# Altium schematic sheet ESC.SchDoc
size A2
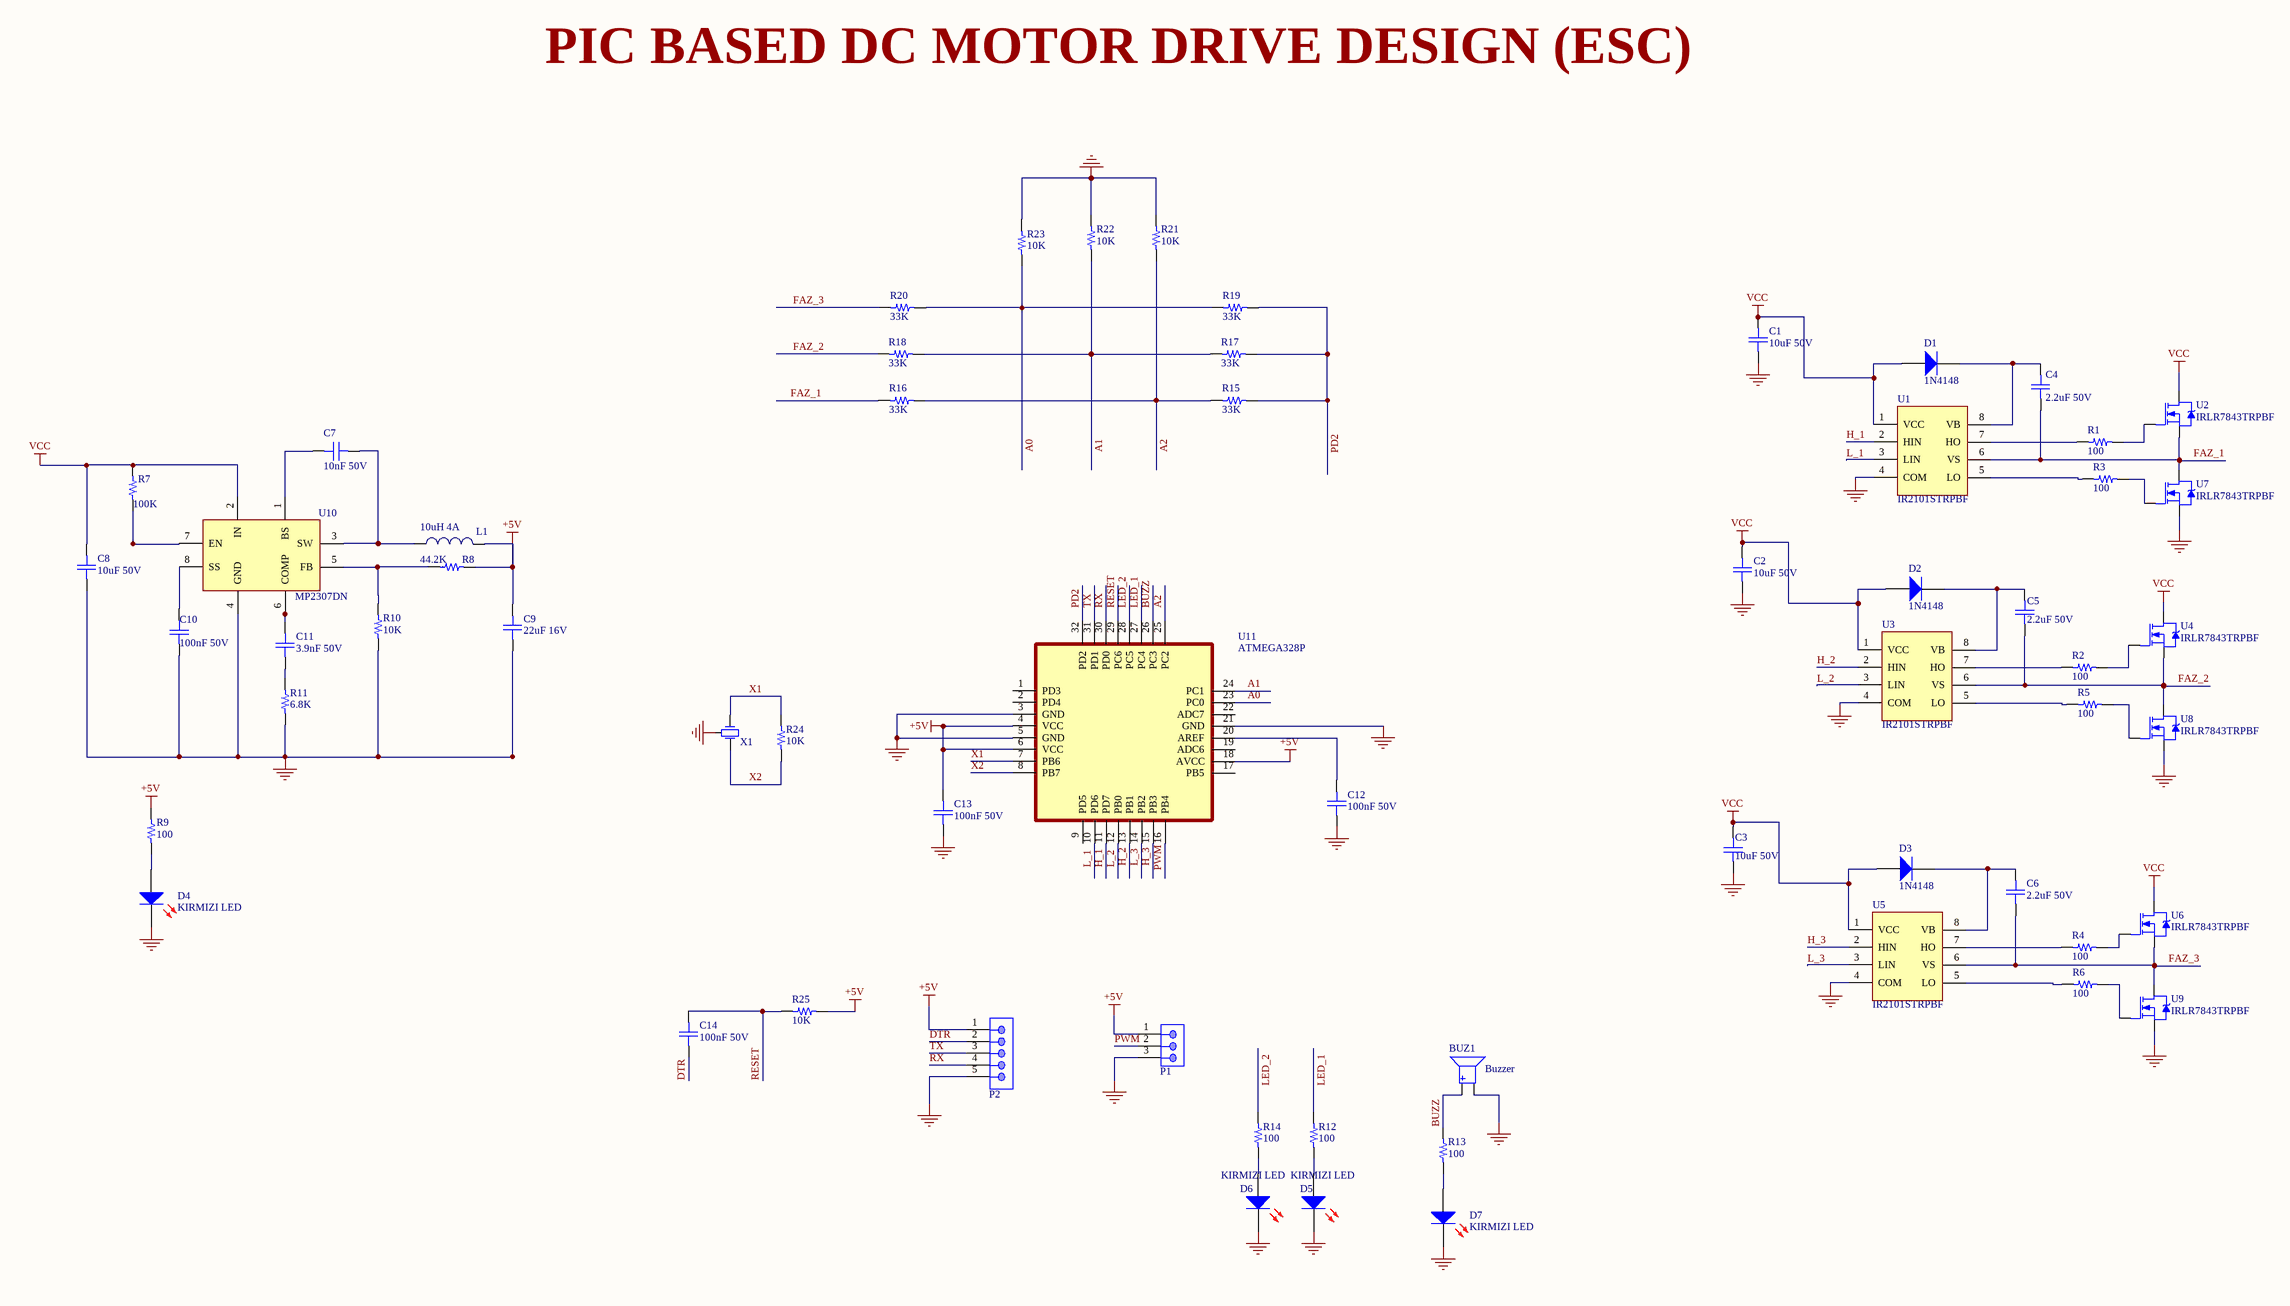
[diagram p0: ESC.SchDoc]

## Parts
BUZ1  Deger: Buzzer  [BUZ: CMT-7525]  (hidden comment: BUZZER MAGN 3.6V 7.5X7.5MM SMD)
C1  Deger: 10uF 50V  [CAP 1206/3216]  (hidden comment: CAP CER 10UF 50V X5R 1206)
C2  Deger: 10uF 50V  [CAP 1206/3216]  (hidden comment: CAP CER 10UF 50V X5R 1206)
C3  Deger: 10uF 50V  [CAP 1206/3216]  (hidden comment: CAP CER 10UF 50V X5R 1206)
C4  Deger: 2.2uF 50V  [CAP 1206/3216]  (hidden comment: CAP CER 2.2UF 50V X5R 1206)
C5  Deger: 2.2uF 50V  [CAP 1206/3216]  (hidden comment: CAP CER 2.2UF 50V X5R 1206)
C6  Deger: 2.2uF 50V  [CAP 1206/3216]  (hidden comment: CAP CER 2.2UF 50V X5R 1206)
C7  Deger: 10nF 50V  [CAP 0805/2012]  (hidden comment: CAP CER 10000PF 50V X7R 0805)
C8  Deger: 10uF 50V  [CAP 1206/3216]  (hidden comment: CAP CER 10UF 50V X5R 1206)
C9  Deger: 22uF 16V  [CAP 1206/3216]  (hidden comment: CAP CERAMIC 22UF 16V X7S 20% PAD)
C10  Deger: 100nF 50V  [CAP 0805/2012]  (hidden comment: CAP CER 0.1UF 50V X7R 0805)
C11  Deger: 3.9nF 50V  [CAP 0805/2012]  (hidden comment: CAP CER 3900PF 50V X7R 0805)
C12  Deger: 100nF 50V  [CAP 0805/2012]  (hidden comment: CAP CER 0.1UF 50V X7R 0805)
C13  Deger: 100nF 50V  [CAP 0805/2012]  (hidden comment: CAP CER 0.1UF 50V X7R 0805)
C14  Deger: 100nF 50V  [CAP 0805/2012]  (hidden comment: CAP CER 0.1UF 50V X7R 0805)
D1  1N4148 Diyot  [SOD-123]  (value not drawn)
D2  1N4148 Diyot  [SOD-123]  (value not drawn)
D3  1N4148 Diyot  [SOD-123]  (value not drawn)
D4  Deger: KIRMIZI LED  [SMD: LED 0805/2012 RED]  (hidden comment: Red 645nm LED Indication - Discrete 1.8V 0805)
D5  Deger: KIRMIZI LED  [SMD: LED 0805/2012 RED]  (hidden comment: Red 645nm LED Indication - Discrete 1.8V 0805)
D6  Deger: KIRMIZI LED  [SMD: LED 0805/2012 RED]  (hidden comment: Red 645nm LED Indication - Discrete 1.8V 0805)
D7  Deger: KIRMIZI LED  [SMD: LED 0805/2012 RED]  (hidden comment: Red 645nm LED Indication - Discrete 1.8V 0805)
L1  FIXED IND 10UH 4A 68 MOHM SMD  [ASPI-0630LR-100M-T15]  (value not drawn)
P1  WR-PHD 2.54 mm Angled Socket Header  [PWM_CONN]  (value not drawn)
P2  WR-PHD 2.54 mm Angled Socket Header  [TTL_CONN_5]  (value not drawn)
R1  100  [RES_0805]
R2  100  [RES_0805]
R3  100  [RES_0805]
R4  100  [RES_0805]
R5  100  [RES_0805]
R6  100  [RES_0805]
R7  100K  [RES_0805]
R8  44.2K  [RES_0805]
R9  100  [RES_0805]
R10  10K  [RES_0805]
R11  6.8K  [RES_0805]
R12  100  [RES_0805]
R13  100  [RES_0805]
R14  100  [RES_0805]
R15  33K  [RES_0805]
R16  33K  [RES_0805]
R17  33K  [RES_0805]
R18  33K  [RES_0805]
R19  33K  [RES_0805]
R20  33K  [RES_0805]
R21  10K  [RES_0805]
R22  10K  [RES_0805]
R23  10K  [RES_0805]
R24  10K  [RES_0805]
R25  10K  [RES_0805]
U1  Deger: IR2101STRPBF  [SOIC8]  (hidden comment: IC GATE DRVR HALF-BRIDGE 8SOIC)
U2  Deger: IRLR7843TRPBF  [DPAK]  (hidden comment: MOSFET N-CH 30V 161A DPAK)
U3  Deger: IR2101STRPBF  [SOIC8]  (hidden comment: IC GATE DRVR HALF-BRIDGE 8SOIC)
U4  Deger: IRLR7843TRPBF  [DPAK]  (hidden comment: MOSFET N-CH 30V 161A DPAK)
U5  Deger: IR2101STRPBF  [SOIC8]  (hidden comment: IC GATE DRVR HALF-BRIDGE 8SOIC)
U6  Deger: IRLR7843TRPBF  [DPAK]  (hidden comment: MOSFET N-CH 30V 161A DPAK)
U7  Deger: IRLR7843TRPBF  [DPAK]  (hidden comment: MOSFET N-CH 30V 161A DPAK)
U8  Deger: IRLR7843TRPBF  [DPAK]  (hidden comment: MOSFET N-CH 30V 161A DPAK)
U9  Deger: IRLR7843TRPBF  [DPAK]  (hidden comment: MOSFET N-CH 30V 161A DPAK)
U10  IC REG BUCK ADJUSTABLE 3A 8SOIC  [SOIC8_PAD]  (value not drawn)
U11  IC MCU 8BIT 32KB FLASH 32TQFP  [TQFP32]  (value not drawn)
X1  CERAMIC RES 16.0000MHZ 15PF SMD  [CRYSTAL_16MHZ(CTSE16)]  (value not drawn)

## Nets
+5V: C9.2 C13.2 L1.2 P1.1 P2.1 R8.2 R9.2 R25.2 U11.4(VCC) U11.6(VCC) U11.18(AVCC)
GND: BUZ1.2(Negative) C1.1 C2.1 C3.1 C8.1 C9.1 C10.1 C12.1 C13.1 D4.2(K) D5.2(K) D6.2(K) D7.2(K) P1.3 P2.5 R10.1 R11.1 R21.1 R22.1 R23.1 U1.4(COM) U3.4(COM) U5.4(COM) U7.3(S) U8.3(S) U9.3(S) U10.4(GND) U11.3(GND) U11.5(GND) U11.21(GND) X1.2(GND)
VCC: C1.2 C2.2 C3.2 C8.2 D1.1(A) D2.1(A) D3.1(A) R7.2 U1.1(VCC) U2.4(D) U3.1(VCC) U4.4(D) U5.1(VCC) U6.4(D) U10.2(IN)
A0: R19.2 R20.1 R23.2 U11.23(PC0)
A1: R17.2 R18.1 R22.2 U11.24(PC1)
A2: R15.2 R16.1 R21.2 U11.25(PC2)
BUZZ: BUZ1.1(Positive) R13.2 U11.26(PC3)
DTR: C14.1 P2.2
FAZ_1: C4.1 R16.2 U1.6(VS) U2.3(S) U7.4(D)
FAZ_2: C5.1 R18.2 U3.6(VS) U4.3(S) U8.4(D)
FAZ_3: C6.1 R20.2 U5.6(VS) U6.3(S) U9.4(D)
H_1: U1.2(HIN) U11.11(PD7)
H_2: U3.2(HIN) U11.13(PB1)
H_3: U5.2(HIN) U11.15(PB3)
L_1: U1.3(LIN) U11.10(PD6)
L_2: U3.3(LIN) U11.12(PB0)
L_3: U5.3(LIN) U11.14(PB2)
LED_1: R12.2 U11.27(PC4)
LED_2: R14.2 U11.28(PC5)
PD2: R15.1 R17.1 R19.1 U11.32(PD2)
PWM: P1.2 U11.16(PB4)
RESET: C14.2 R25.1 U11.29(PC6)
RX: P2.4 U11.30(PD0)
TX: P2.3 U11.31(PD1)
X1: R24.1 U11.7(PB6) X1.1(OSC1)
X2: R24.2 U11.8(PB7) X1.3(OSC2)
NetC4_2: C4.2 D1.2(K) U1.8(VB)
NetC5_2: C5.2 D2.2(K) U3.8(VB)
NetC6_2: C6.2 D3.2(K) U5.8(VB)
NetC7_1: C7.1 U10.1(BS)
NetC7_2: C7.2 L1.1 U10.3(SW)
NetC10_2: C10.2 U10.8(SS)
NetC11_1: C11.1 R11.2
NetC11_2: C11.2 U10.6(COMP)
NetC12_2: C12.2 U11.20(AREF)
NetD4_1: D4.1(A) R9.1
NetD5_1: D5.1(A) R12.1
NetD6_1: D6.1(A) R14.1
NetD7_1: D7.1(A) R13.1
NetR1_1: R1.1 U1.7(HO)
NetR1_2: R1.2 U2.1(G)
NetR2_1: R2.1 U3.7(HO)
NetR2_2: R2.2 U4.1(G)
NetR3_1: R3.1 U1.5(LO)
NetR3_2: R3.2 U7.1(G)
NetR4_1: R4.1 U5.7(HO)
NetR4_2: R4.2 U6.1(G)
NetR5_1: R5.1 U3.5(LO)
NetR5_2: R5.2 U8.1(G)
NetR6_1: R6.1 U5.5(LO)
NetR6_2: R6.2 U9.1(G)
NetR7_1: R7.1 U10.7(EN)
NetR8_1: R8.1 R10.2 U10.5(FB)

Not connected (* = marked no-connect by the designer): U11 1(PD3) 2(PD4) 9(PD5) 17(PB5) 19(ADC6) 22(ADC7)

## Notes on the sheet
- PIC BASED DC MOTOR DRIVE DESIGN (ESC)

## Library data of the parts
BUZ1 = Buzzer(CMT-7525-80-SMT-TR): Buzzers Transducer, Externally Driven Magnetic 3.6V 100mA 2.73kHz 80dB @ 3.6V, 10cm Surface Mount Solder Pads; Kılıf: Nonstandard; -Sicaklik: -40; +Sicaklik: +85; Cins: Buzzer; Uretici Kodu: CMT-7525-80-SMT-TR; MSL: 1 (Unlimited); Lehim Yöntemi: SMD
C1-C3 C8 = 10uF 50V 1206: 10µF ±10% 50V Ceramic Capacitor X5R 1206 (3216 Metric); Cins: Kondansator; Uretici Kodu: CL31A106KBHNNNE; Kılıf: 1206; -Sicaklik: -55; +Sicaklik: +125; Lehim Yöntemi: SMD; MSL: 1 (Unlimited)
C4-C6 = 2.2uF 50V 1206: 2.2µF ±10% 50V Ceramic Capacitor X5R 1206 (3216 Metric); Cins: Kondansator; Uretici Kodu: CL31A225KBHNNNE; Kılıf: 1206; -Sicaklik: -55; +Sicaklik: +85; Lehim Yöntemi: SMD; MSL: 1 (Unlimited)
C7 = 10nF 50V 0805: 10000pF ±10% 50V Ceramic Capacitor X7R 0805 (2012 Metric); Cins: Kondansator; Uretici Kodu: CL21B103KBANNNC; Kılıf: 0805; -Sicaklik: -55; +Sicaklik: +125; Lehim Yöntemi: SMD; MSL: 1 (Unlimited)
C9 = 22uF 16V 1206: 22µF ±20% 16V Ceramic Capacitor X7S 1206 (3216 Metric); Cins: Kondansator; Uretici Kodu: GRM31CC71C226ME11L; Kılıf: 1206; -Sicaklik: -55; +Sicaklik: +125; Lehim Yöntemi: SMD; MSL: 1 (Unlimited)
C10 C12-C14 = 100nF 50V 0805: 0.1µF ±10% 50V Ceramic Capacitor X7R 0805 (2012 Metric); Kılıf: 0805; Cins: Kondansator; Uretici Kodu: CL21B104KBCNNNC; -Sicaklik: -55; +Sicaklik: +125; Lehim Yöntemi: SMD; MSL: 1 (Unlimited)
C11 = 3.9nF 50V 0805: 3900pF ±10% 50V Ceramic Capacitor X7R 0805 (2012 Metric); Cins: Kondansator; Uretici Kodu: CL21B392KBANNNC; Kılıf: 0805; -Sicaklik: -55; +Sicaklik: +125; Lehim Yöntemi: SMD; MSL: 1 (Unlimited)
D1-D3 = 1N4148: DIODE GEN PURP 100V 150MA SOD123; Uretici Kodu: 1N4148W-TP; -Sicaklik: -65; +Sicaklik: +150; Lehim Yöntemi: SMD; Cins: Diyot; Kılıf: SOD123; MSL: 1 (Unlimited); Deger: 1N4148
D4-D7 = LED_Kırmızı: LED RED DIFFUSED 0805 SMD; Uretici Kodu: LH R974-LP-1; Kılıf: 0805; -Sicaklik: -40; +Sicaklik: +125; Cins: LED; Lehim Yöntemi: SMD; MSL: 1 (Unlimited)
L1 = 10uH 4A: 10µH Shielded Molded Inductor 4A 68mOhm Max Nonstandard; Cins: Bobin; -Sicaklik: -55; +Sicaklik: +125; Uretici Kodu: ASPI-0630LR-100M-T15; Kılıf: Nonstandard; Lehim Yöntemi: SMD; MSL: 1 (Unlimited); Deger: 10uH 4A
P1 = HDR(1X3): Cins: Konnektor; Uretici Kodu: 613003143121; Kılıf: 3POS 2.54MM; -Sicaklik: -40; +Sicaklik: +105; Lehim Yöntemi: MANUEL; MSL: 1 (Unlimited)
P2 = HDR(1X5): Cins: Konnektor; Uretici Kodu: 613005143121; Kılıf: 5POS 2.54MM; -Sicaklik: -40; +Sicaklik: +105; Lehim Yöntemi: MANUEL; MSL: 1 (Unlimited)
R1-R6 R9 R12-R14 = 100R 0805: 100 Ohms ±1% 0.125W, 1/8W Chip Resistor 0805 (2012 Metric) Moisture Resistant Thick Film; Cins: Direnc; Uretici Kodu: RC0805FR-07100RL; Kılıf: 0805; -Sicaklik: -55; +Sicaklik: +155; Lehim Yöntemi: SMD; Deger: 100R; MSL: 1 (Unlimited)
R7 = 100K 0805: 100 kOhms ±1% 0.125W, 1/8W Chip Resistor 0805 (2012 Metric) Moisture Resistant Thick Film; Cins: Direnc; Uretici Kodu: RC0805FR-07100KL; Kılıf: 0805; -Sicaklik: -55; +Sicaklik: +155; Lehim Yöntemi: SMD; MSL: 1 (Unlimited); Deger: 100K
R8 = 44.2K 0805: 44.2 kOhms ±1% 0.125W, 1/8W Chip Resistor 0805 (2012 Metric) Moisture Resistant Thick Film; Cins: Direnc; Uretici Kodu: RC0805FR-0744K2L; Kılıf: 0805; -Sicaklik: -55; +Sicaklik: +155; Lehim Yöntemi: SMD; MSL: 1 (Unlimited); Deger: 44.2K
R10 R21-R25 = 10K 0805: 10 kOhms ±1% 0.125W, 1/8W Chip Resistor 0805 (2012 Metric) Moisture Resistant Thick Film; Cins: Direnc; Kılıf: 0805; Uretici Kodu: RC0805FR-0710KL; -Sicaklik: -55; +Sicaklik: +155; Lehim Yöntemi: SMD; MSL: 1 (Unlimited); Deger: 10K
R11 = 6.8K 0805: 6.8 kOhms ±1% 0.125W, 1/8W Chip Resistor 0805 (2012 Metric) Moisture Resistant Thick Film; Cins: Direnc; Kılıf: 0805; Uretici Kodu: RC0805FR-076K8L; -Sicaklik: -55; +Sicaklik: +155; Lehim Yöntemi: SMD; MSL: 1 (Unlimited); Deger: 6.8K
R15-R20 = 33K 0805: 33 kOhms ±1% 0.125W, 1/8W Chip Resistor 0805 (2012 Metric) Moisture Resistant Thick Film; Cins: Direnc; Kılıf: 0805; -Sicaklik: -55; +Sicaklik: +155; Uretici Kodu: RC0805FR-0733KL; Lehim Yöntemi: SMD; MSL: 1 (Unlimited); Deger: 33K
U1 U3 U5 = IR2101: Half-Bridge Gate Driver IC Non-Inverting 8-SOIC; -Sicaklik: -40; +Sicaklik: +150; Lehim Yöntemi: SMD; Cins: IC; Uretici Kodu: IR2101STRPBF; Kılıf: 8-SOIC; MSL: 2A (4 Weeks)
U2 U4 U6-U9 = IRLR7843: N-Channel 30V 161A (Tc) 140W (Tc) Surface Mount D-Pak; Kılıf: DPAK(TO-252-3); -Sicaklik: -55; +Sicaklik: +175; Lehim Yöntemi: SMD; Cins: MOSFET; Uretici Kodu: IRLR7843TRPBF; MSL: 1 (Unlimited)
U10 = MP2307DN: Buck Switching Regulator IC Positive Adjustable 0.925V 1 Output 3A 8-SOIC (0.154", 3.90mm Width) Exposed Pad; Uretici Kodu: MP2307DN-LF-Z; -Sicaklik: -40; +Sicaklik: +85; Lehim Yöntemi: SMD; Cins: IC; Kılıf: 8-SOIC; MSL: 2A (4 Weeks); Deger: MP2307DN
U11 = ATMEGA328P: AVR AVR® ATmega Microcontroller IC 8-Bit 20MHz 32KB (16K x 16) FLASH 32-TQFP (7x7); Uretici Kodu: RC0805FR-07100RL; -Sicaklik: -40; +Sicaklik: +85; Lehim Yöntemi: SMD; Cins: IC; Kılıf: 32-TQFP; MSL: 3 (168 Hours); Deger: ATMEGA328P
X1 = CRYSTAL 16.0000MHZ(CSTCE16M0V53-R0): 16MHz Ceramic Resonator Built in Capacitor 15pF ±0.3%  -20°C ~ 80°C Surface Mount; Cins: Kristal; Kılıf: 3-SMD; -Sicaklik: -20; +Sicaklik: +80; Deger: 16 MHZ 15PF; Uretici Kodu: CSTCE16M0V53-R0; Lehim Yöntemi: SMD; MSL: 1 (Unlimited)